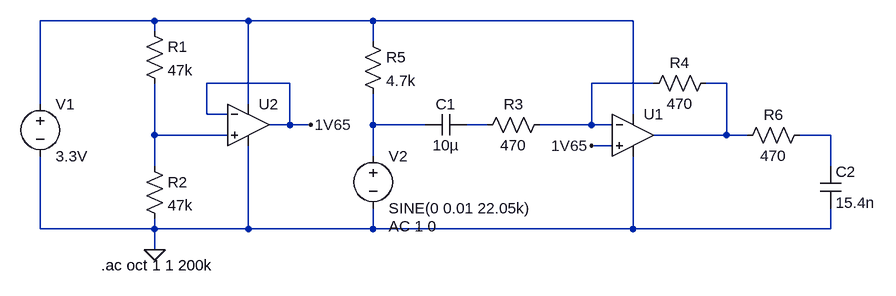
[diagram p0: schematic Amplifier Circuit.asc]
Amplifier Circuit.asc, the LTspice schematic file:
Version 4
SHEET 1 880 680
WIRE -400 -16 -576 -16
WIRE -256 -16 -400 -16
WIRE -64 -16 -256 -16
WIRE 336 -16 -64 -16
WIRE -400 0 -400 -16
WIRE -64 16 -64 -16
WIRE -192 80 -320 80
WIRE 368 80 272 80
WIRE 480 80 448 80
WIRE -576 112 -576 -16
WIRE -256 112 -256 -16
WIRE -320 128 -320 80
WIRE -288 128 -320 128
WIRE 336 128 336 -16
WIRE -192 144 -192 80
WIRE -192 144 -224 144
WIRE -160 144 -192 144
WIRE -64 144 -64 96
WIRE 16 144 -64 144
WIRE 112 144 80 144
WIRE 272 144 272 80
WIRE 272 144 192 144
WIRE 304 144 272 144
WIRE -400 160 -400 80
WIRE -288 160 -400 160
WIRE 480 160 480 80
WIRE 480 160 368 160
WIRE 512 160 480 160
WIRE 640 160 592 160
WIRE 304 176 272 176
WIRE -64 192 -64 144
WIRE -400 208 -400 160
WIRE 640 208 640 160
WIRE -576 304 -576 192
WIRE -400 304 -400 288
WIRE -400 304 -576 304
WIRE -256 304 -256 176
WIRE -256 304 -400 304
WIRE -64 304 -64 272
WIRE -64 304 -256 304
WIRE 336 304 336 192
WIRE 336 304 -64 304
WIRE 640 304 640 272
WIRE 640 304 336 304
WIRE -400 336 -400 304
FLAG -400 336 0
FLAG -160 144 1V65
FLAG 272 176 1V65
SYMBOL OpAmps\\UniversalOpamp2 336 160 R0
SYMATTR InstName U1
SYMBOL voltage -576 96 R0
WINDOW 123 24 124 Left 2
WINDOW 39 0 0 Left 0
SYMATTR InstName V1
SYMATTR Value 3.3V
SYMBOL OpAmps\\UniversalOpamp2 -256 144 R0
SYMATTR InstName U2
SYMBOL res -416 -16 R0
SYMATTR InstName R1
SYMATTR Value 47k
SYMBOL res -416 192 R0
SYMATTR InstName R2
SYMATTR Value 47k
SYMBOL voltage -64 176 R0
WINDOW 123 24 124 Left 2
WINDOW 39 0 0 Left 0
SYMATTR InstName V2
SYMATTR Value SINE(0 0.01 22.05k)
SYMATTR Value2 AC 1 0
SYMBOL res 208 128 R90
WINDOW 0 0 56 VBottom 2
WINDOW 3 32 56 VTop 2
SYMATTR InstName R3
SYMATTR Value 470
SYMBOL res 464 64 R90
WINDOW 0 0 56 VBottom 2
WINDOW 3 32 56 VTop 2
SYMATTR InstName R4
SYMATTR Value 470
SYMBOL res -80 0 R0
SYMATTR InstName R5
SYMATTR Value 4.7k
SYMBOL res 608 144 R90
WINDOW 0 0 56 VBottom 2
WINDOW 3 32 56 VTop 2
SYMATTR InstName R6
SYMATTR Value 470
SYMBOL cap 624 208 R0
SYMATTR InstName C2
SYMATTR Value 15.4n
SYMBOL cap 80 128 R90
WINDOW 0 0 32 VBottom 2
WINDOW 3 32 32 VTop 2
SYMATTR InstName C1
SYMATTR Value 10µ
TEXT -482 360 Left 2 !.ac oct 1 1 200k

The netlist it stands for:
* Amplifier Circuit.asc
XU1 1V65 N002 N001 0 N003 level.2 Avol=1Meg GBW=10Meg Slew=10Meg ilimit=25m rail=0 Vos=0 phimargin=45 en=0 enk=0 in=0 ink=0 Rin=500Meg  ; pins IN+ IN- V+ V- OUT
V1 N001 0 3.3V
XU2 N006 1V65 N001 0 1V65 level.2 Avol=1Meg GBW=10Meg Slew=10Meg ilimit=25m rail=0 Vos=0 phimargin=45 en=0 enk=0 in=0 ink=0 Rin=500Meg  ; pins IN+ IN- V+ V- OUT
R1 N001 N006 47k
R2 N006 0 47k
V2 N004 0 SINE(0 0.01 22.05k) AC 1 0
R3 N002 N005 470
R4 N003 N002 470
R5 N001 N004 4.7k
R6 N007 N003 470
C2 N007 0 15.4n
C1 N005 N004 10µ
.ac oct 1 1 200k
.lib UniversalOpamps2.sub
.backanno
.end